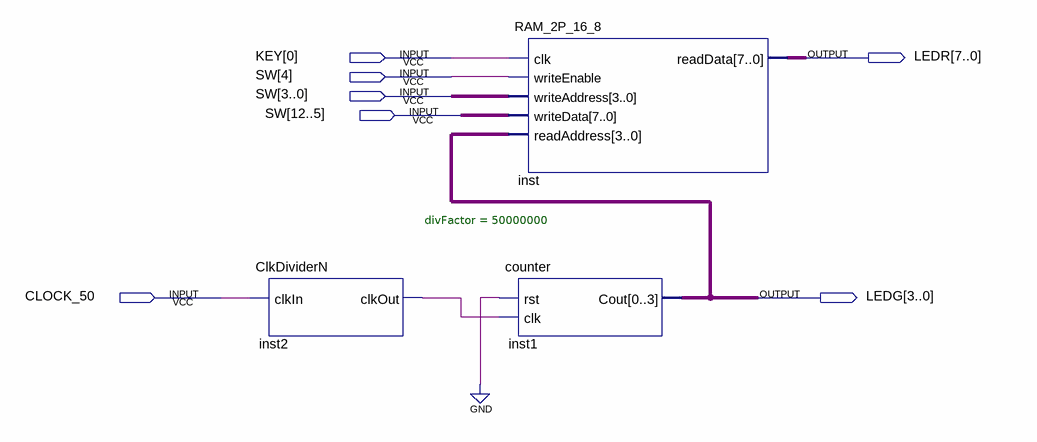
[diagram p0: schematic sheet]
// Quartus schematic RAM_2P_Demo.bdf as structural Verilog: 3 symbols, 7 pins
module RAM_2P_Demo (
  input  [0:0] KEY,
  input  [12:0] SW,
  input  CLOCK_50,
  output [7:0] LEDR,
  output [3:0] LEDG
);

  wire inst2_clkout;

  ClkDividerN #(.divFactor(50000000)) inst2 (.clkIn(CLOCK_50), .clkOut(inst2_clkout));
  RAM_2P_16_8 inst (
    .clk(KEY[0]), .writeEnable(SW[4]), .writeAddress(SW[3:0]), .writeData(SW[12:5]), .readAddress(LEDG),
    .readData(LEDR));
  counter inst1 (.rst(1'b0), .clk(inst2_clkout), .Cout(LEDG));
endmodule
